# EAGLE design avr_saber_mini (EAGLE 6.5.0)
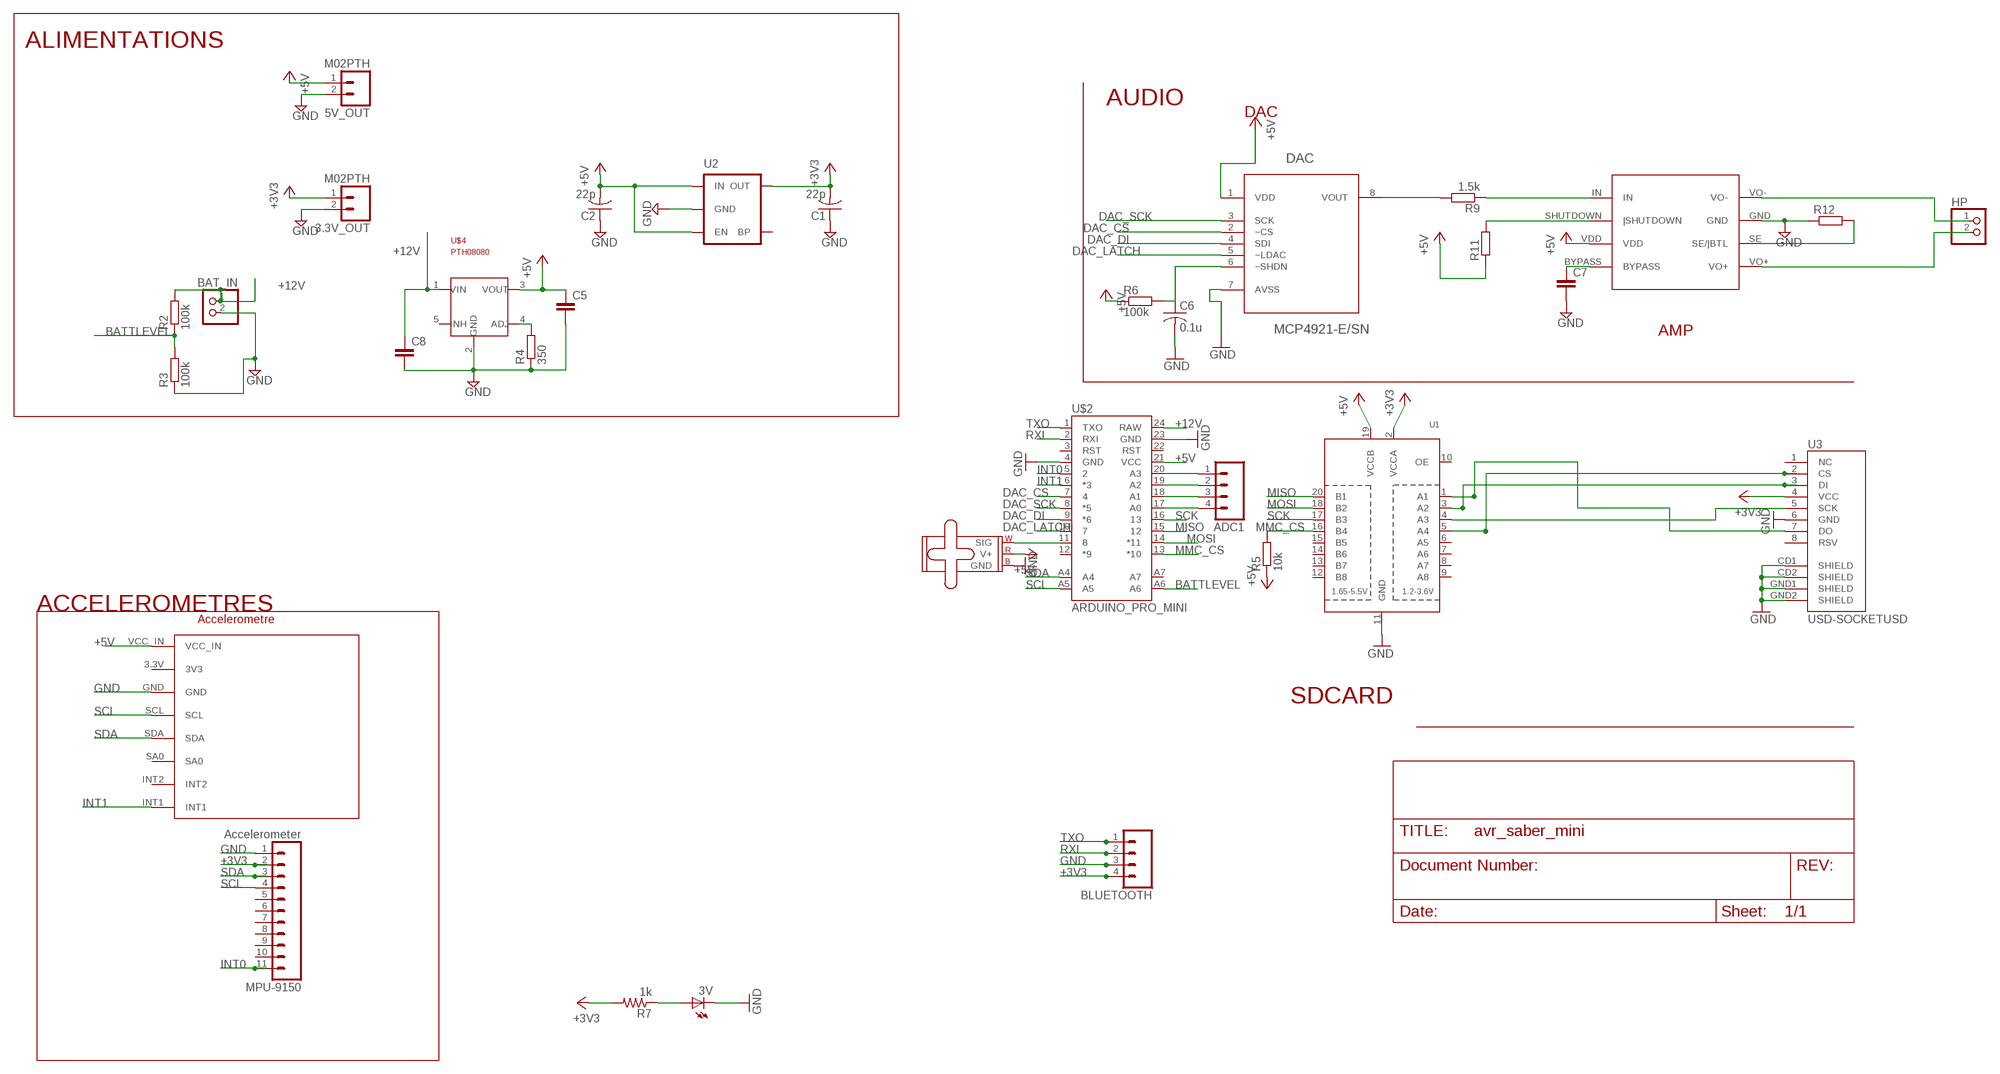
[diagram p0: schematic, sheet 1]

## Parts
3.3V_OUT  M02PTH  [1X02]
3V  LEDSML0805  [SML0805]
5V_OUT  M02PTH  [1X02]
ADC1  M04PTH  [1X04]
BAT_IN  PINHD-1X2  [1X02]
BLUETOOTH  M04PTH  [1X04]
C1  22p  C-USC0805  [C0805]
C2  22p  C-USC0805  [C0805]
C5  C-EUC1206K  [C1206K]
C6  0.1u  C-USC0805  [C0805]
C7  C-EU025-025X050  [C025-025X050]
C8  C-EUC1206K  [C1206K]
DAC  MCP4921-E/SN  [SOIC8-N_MC]
HP  PINHD-1X2  [1X02]
LED1  SMALL_SERVO  [1X03]
MMA8451  DEV  [MMA8451]
MPU-9150  Accelerometer  M11PTH  [1X11]
R2  100k  R-EU_R0805  [R0805]
R3  100k  R-EU_R0805  [R0805]
R4  350  R-EU_R0805  [R0805]
R5  10k  R-EU_R0805  [R0805]
R6  100k  R-EU_R0805  [R0805]
R7  1k  R-US_M0805  [M0805]
R9  1.5k  R-EU_R0805  [R0805]
R11  R-EU_R0805  [R0805]
R12  R-EU_R0805  [R0805]
U1  TXB0108PWR  [TSSOP20]
U2  MIC52053.3V  [SOT23-5]
U3  USD-SOCKETUSD  [USD-SOCKET-PP]
U$1  TPA0211  [TPA0211]
U$2  ARDUINO_PRO_MINI  [ARDUINO_PRO_MINI]
U$4  PTH08080  [PTH08080EUF]

## Nets
+3V3: 3.3V_OUT.1 BLUETOOTH.4 C1.2 MPU-9150.2 R7.2 U1.2(VCCA) U2.5(OUT) U3.4(VCC)
+5V: 5V_OUT.1 C2.2 C5.1 DAC.1(VDD) LED1.2(V+) MMA8451.VCC_IN R5.1 R6.1 R11.1 U1.19(VCCB) U2.1(IN) U2.3(EN) U$1.VDD U$2.21(VCC) U$4.3(VOUT)
+12V: BAT_IN.1 C8.1 R2.2 U$2.24(RAW) U$4.1(VIN)
BATTLEVEL: R2.1 R3.2 U$2.A6
DAC_CS: DAC.2(~CS) U$2.7
DAC_DI: DAC.4(SDI) U$2.9(*6)
DAC_LATCH: DAC.5(~LDAC) U$2.10
DAC_SCK: DAC.3(SCK) U$2.8(*5)
GND: 3.3V_OUT.2 3V.C 5V_OUT.2 BAT_IN.2 BLUETOOTH.3 C1.1 C2.1 C5.2 C6.2 C7.2 C8.2 DAC.7(AVSS) LED1.3(GND) MMA8451.GND MPU-9150.1 R3.1 R4.1 R12.1 U1.11(GND) U2.2(GND) U3.6(GND) U3.CD1(SHIELD) U3.CD2(SHIELD) U3.GND1(SHIELD) U3.GND2(SHIELD) U$1.GND U$2.4(GND) U$2.23(GND) U$4.2(GND)
INT0: MPU-9150.11 U$2.5
INT1: MMA8451.INT1 U$2.6(*3)
MISO: U1.20(B1) U$2.15
MMC_CS: R5.2 U1.16(B4) U$2.13(*10)
MOSI: U1.18(B2) U$2.14(*11)
N$3: R9.1 U$1.IN
N$4: ADC1.1 U$2.20(A3)
N$5: R4.2 U$4.4(ADJ)
N$6: U1.4(A3) U3.5(SCK)
N$7: U1.1(A1) U3.7(DO)
N$9: U1.5(A4) U3.2(CS)
N$10: 3V.A R7.1
N$11: U1.3(A2) U3.3(DI)
N$14: ADC1.2 U$2.19(A2)
N$15: DAC.8(VOUT) R9.2
N$16: ADC1.3 U$2.18(A1)
N$17: ADC1.4 U$2.17(A0)
N$18: LED1.1(SIG) U$2.11
N$19: C6.1 DAC.6(~SHDN) R6.2
N$22: HP.1 U$1.VO-
N$23: C7.1 U$1.BYPASS
N$32: R11.2 U$1.SHUTDOWN(|SHUTDOWN)
N$33: R12.2 U$1.SE(SE/|BTL)
RXI: BLUETOOTH.2 U$2.2(RXI)
SCK: U1.17(B3) U$2.16
SCL: MMA8451.SCL MPU-9150.4 U$2.A5
SDA: MMA8451.SDA MPU-9150.3 U$2.A4
TXO: BLUETOOTH.1 U$2.1(TXO)
VO+: HP.2 U$1.VO+
Unconnected: MMA8451.3.3V(3V3) MMA8451.INT2 MMA8451.SA0 MPU-9150.5 MPU-9150.6 MPU-9150.7 MPU-9150.8 MPU-9150.9 MPU-9150.10 U1.6(A5) U1.7(A6) U1.8(A7) U1.9(A8) U1.10(OE) U1.12(B8) U1.13(B7) U1.14(B6) U1.15(B5) U2.4(BP) U3.1(NC) U3.8(RSV) U$2.3(RST) U$2.12(*9) U$2.22(RST) U$2.A7 U$4.5(INH)

## Notes on the sheet
- ALIMENTATIONS
- AUDIO
- DAC
- AMP
- ACCELEROMETRES
- Accelerometre
- SDCARD

## Library data of the parts
3.3V_OUT 5V_OUT = SparkFun-Connectors:M02: Standard 2-pin 0.1" header. Use with - straight break away headers ( PRT-00116) - right angle break away headers (PRT-00553) - swiss pins (PRT-00743) - machine pins (PRT-00117) - female headers (PRT-00115) Molex polarized connector foot print use with: PRT-08233 with associated crimp pins and housings. 2.54_SCREWTERM for use with PRT-10571. 3.5mm Screw Terminal footprints for PRT-08084 5mm Screw Terminal footprints for use with PRT-08433
3V = led:LED: LED OSRAM: - CHIPLED LG R971, LG N971, LY N971, LG Q971, LY Q971, LO R971, LY R971 LH N974, LH R974 LS Q976, LO Q976, LY Q976 LO Q996 - Hyper CHIPLED LW Q18S LB Q993, LB Q99A, LB R99A - SideLED LS A670, LO A670, LY A670, LG A670, LP A670 LB A673, LV A673, LT A673, LW A673 LH A674 LY A675 LS A676, LA A676, LO A676, LY A676, LW A676 LS A679, LY A679, LG A679 - Hyper Micro SIDELED® LS Y876, LA Y876, LO Y876, LY Y876 LT Y87S - SmartLED LW L88C, LW L88S LB L89C, LB L89S, LG L890 LS L89K, LO L89K, LY L89K LS L896, LA L896, LO L896, LY L896 - TOPLED LS T670, LO T670, LY T670, LG T670, LP T670 LSG T670, LSP T670, LSY T670, LOP T670, LYG T670 LG T671, LOG T671, LSG T671 LB T673, LV T673, LT T673, LW T673 LH T674 LS T676, LA T676, LO T676, LY T676, LB T676, LH T676, LSB T676, LW T676 LB T67C, LV T67C, LT T67C, LS T67K, LO T67K, LY T67K, LW E67C LS E67B, LA E67B, LO E67B, LY E67B, LB E67C, LV E67C, LT E67C LW T67C LS T679, LY T679, LG T679 LS T770, LO T770, LY T770, LG T770, LP T770 LB T773, LV T773, LT T773, LW T773 LH T774 LS E675, LA E675, LY E675, LS T675 LS T776, LA T776, LO T776, LY T776, LB T776 LHGB T686 LT T68C, LB T68C - Hyper Mini TOPLED® LB M676 - Mini TOPLED Santana® LG M470 LS M47K, LO M47K, LY M47K Source: http://www.osram.convergy.de LUXEON: - LUMILED® LXK2-PW12-R00, LXK2-PW12-S00, LXK2-PW14-U00, LXK2-PW14-V00 LXK2-PM12-R00, LXK2-PM12-S00, LXK2-PM14-U00 LXK2-PE12-Q00, LXK2-PE12-R00, LXK2-PE12-S00, LXK2-PE14-T00, LXK2-PE14-U00 LXK2-PB12-K00, LXK2-PB12-L00, LXK2-PB12-M00, LXK2-PB14-N00, LXK2-PB14-P00, LXK2-PB14-Q00 LXK2-PR12-L00, LXK2-PR12-M00, LXK2-PR14-Q00, LXK2-PR14-R00 LXK2-PD12-Q00, LXK2-PD12-R00, LXK2-PD12-S00 LXK2-PH12-R00, LXK2-PH12-S00 LXK2-PL12-P00, LXK2-PL12-Q00, LXK2-PL12-R00 Source: www.luxeon.com KINGBRIGHT: KA-3528ASYC Source: www.kingbright.com
ADC1 BLUETOOTH = SparkFun-Connectors:M04: Header 4 Standard 4-pin 0.1" header. Use with straight break away headers (SKU : PRT-00116), right angle break away headers (PRT-00553), swiss pins (PRT-00743), machine pins (PRT-00117), and female headers (PRT-00115). Molex polarized connector foot print use with SKU : PRT-08231 with associated crimp pins and housings. 1MM SMD Version SKU: PRT-10208
BAT_IN HP = pinhead:PINHD-1X2: PIN HEADER
C1 C2 C6 = adafruit:C-US: CAPACITOR, American symbol
C5 C7 C8 = rcl:C-EU: CAPACITOR, European symbol
DAC = Microchip_By_element14_Batch_1:MCP4921-E/SN: 12 Bit DAC; DESCRIPTION: 12 Bit DAC; MPN: MCP4921-E/SN; OC_FARNELL: 1332113; OC_NEWARK: 08J8744; PACKAGE: SOIC-8; SUPPLIER: Microchip
LED1 = SparkFun-Electromechanical:SMALL_SERVO: Small servo motor This is the small servo used in the SIK. SKU: ROB-09065
MMA8451 = MMA8451_miniboard:DEV
MPU-9150 = SparkFun-Connectors:M11: Header 11 Standard 11-pin 0.1" header. Use with straight break away headers (SKU : PRT-00116), right angle break away headers (PRT-00553), swiss pins (PRT-00743), machine pins (PRT-00117), and female headers (PRT-00115).
R2-R6 R9 R11 R12 = rcl:R-EU_: RESISTOR, European symbol
R7 = rcl:R-US_: RESISTOR, American symbol
U1 = adafruit:TXB0108PWR: 8-Bit Bi-Directional Level Shifter 1.2V-3.6V (VCCA) to 1.65V-5.5V (VCCB) bi-directional level shifter with auto direction sensing. Max data rate - VCCA 1.8V: 20Mbps (50ns), VCCA 3.3V: 100Mbps (10ns) Digikey: 296-21527-1-ND
U2 = SparkFun-PowerIC:MIC5205: MIC5205 150mA vreg 3.3V - VREG-00822 5V - VREG-00823; PROD_ID: VREG-00822
U3 = SparkFun-Connectors:USD-SOCKET: microSD Socket Push-push type uSD socket. Schematic element and footprint production proven. Spark Fun Electronics SKU : PRT-00127. tDoc lines correctly indicate media card edge positions when inserting (unlocked, locked, depressed).
U$1 = TPA0211:TPA0211
U$2 = SparkFun-Boards:ARDUINO_PRO_MINI
U$4 = PTH08080:PTH08080: DC-DC, Vin 5..18V, Vout 2..6V, 2A www.ti.com

## Net classes
1 power: width 0.508 mm

## Board
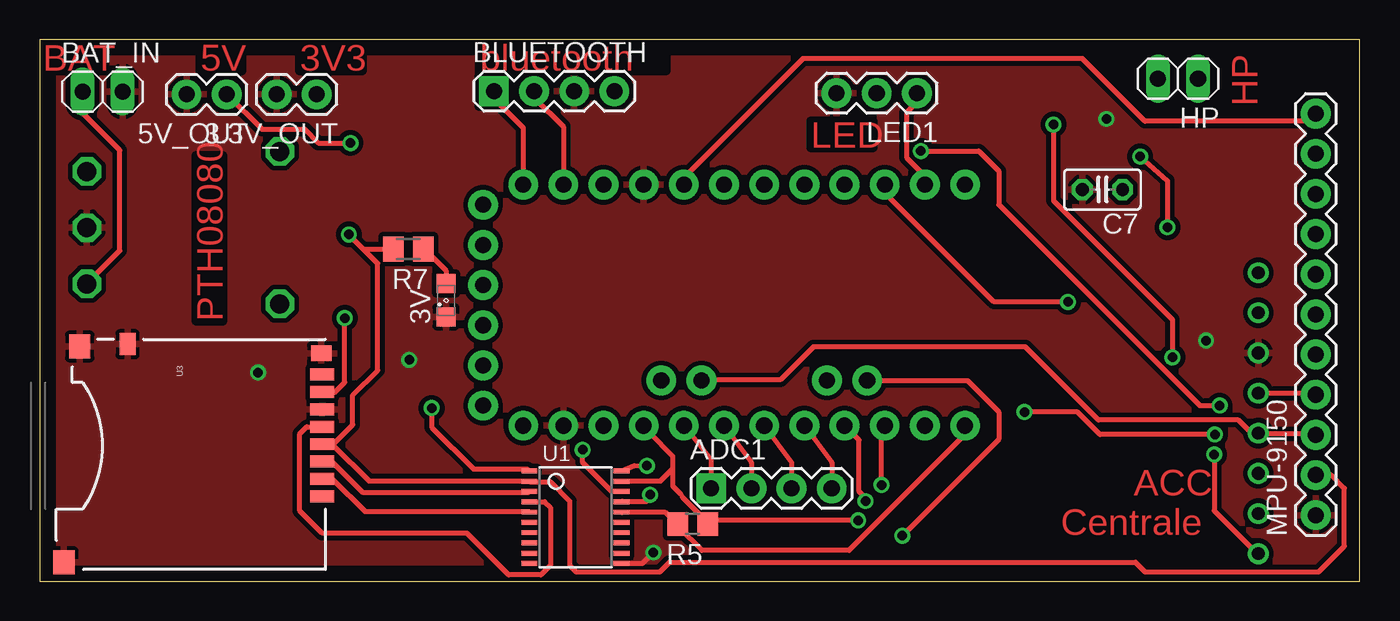
[diagram p1: board, top side]
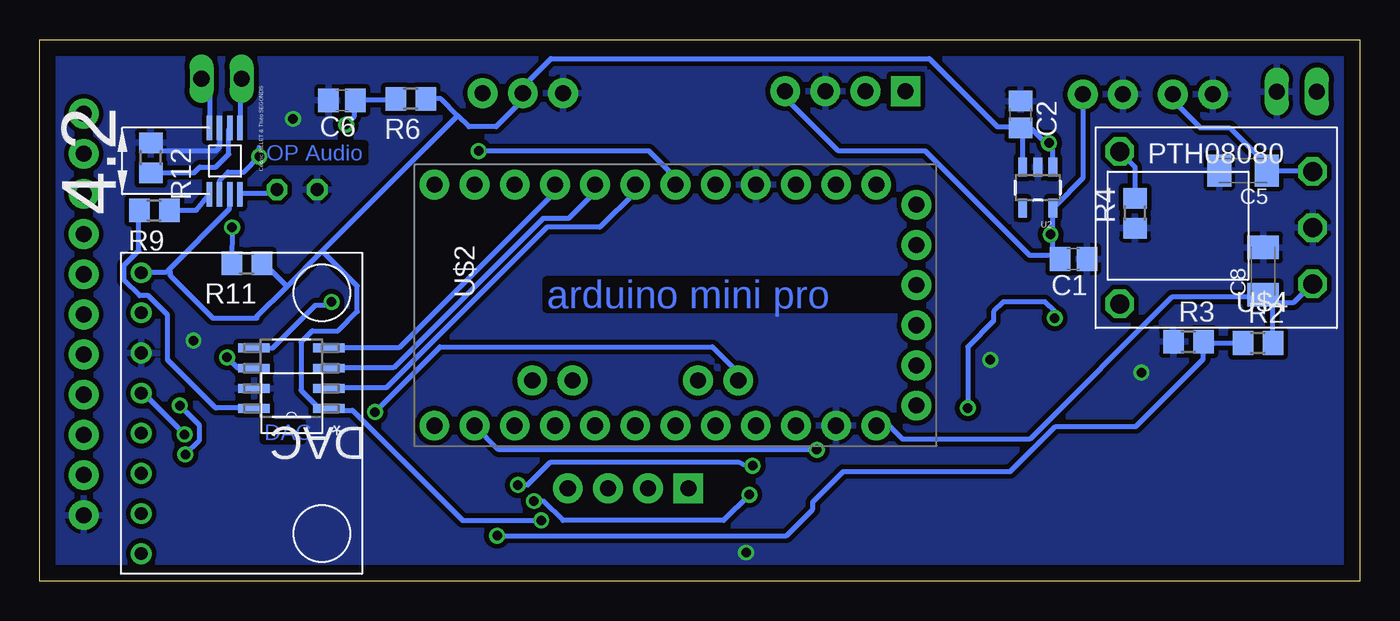
[diagram p2: board, bottom side, seen from below]

Size 83.49 x 34.28 mm. Coordinates in mm from the lower left corner, seen from the top.
Outline: 0,0 83.49,0 83.49,34.28 0,34.28 0,0
Copper layers (1*16): Top 0.035mm / dielectric 1.5mm / Bottom 0.035mm
Design rules "default *": minimum track width 12mil, minimum drill 0.6mm, track to track 10mil, track to pad 10mil, pad to pad 10mil, via to via 10mil, smd to smd 8mil, copper to edge 40mil, drill to drill 10mil, minimum pad ring 10mil, minimum via ring 8mil, stop-mask expansion 4mil, vias tented up to drill 0mil, thermal gap 10mil

### Footprints (pad centres in the part's own frame; a part is rotated, then mirrored left to right if it is on the bottom)
1X02 = drill 1.016 pad 1.88: 1 0,0; 2 2.54,0
SML0805 = smd 1.2 x 1.2: A 1.05,0; C -1.05,0
1X04 = drill 1.016 pad 1.88 square: 1 0,0 | drill 1.016 pad 1.88: 2 2.54,0; 3 5.08,0; 4 7.62,0
1X02' = drill 1.016 long: 1 -1.27,0; 2 1.27,0
C0805 = smd 1.3 x 1.5: 1 -0.85,0; 2 0.85,0
C1206K = smd 1.5 x 2: 1 -1.5,0; 2 1.5,0
C025-025X050 = drill 0.813 octagon: 1 -1.27,0; 2 1.27,0
SOIC8-N_MC = smd 1.981 x 0.559: 1 -2.362,1.905; 2 -2.362,0.635; 3 -2.362,-0.635; 4 -2.362,-1.905; 5 2.362,-1.905; 6 2.362,-0.635; 7 2.362,0.635; 8 2.362,1.905
1X03 = drill 1.016 pad 1.88: 1 0,0; 2 2.54,0; 3 5.08,0
MMA8451 = drill 0.8: 3.3V -7.62,6.35; GND -7.62,3.81; INT1 -7.62,-8.89; INT2 -7.62,-6.35; SA0 -7.62,-3.81; SCL -7.62,1.27; SDA -7.62,-1.27; VCC_IN -7.62,8.89
1X11 = drill 1.016 pad 1.88: 1 0,0; 2 2.54,0; 3 5.08,0; 4 7.62,0; 5 10.16,0; 6 12.7,0; 7 15.24,0; 8 17.78,0; 9 20.32,0; 10 22.86,0; 11 25.4,0
R0805 = smd 1.3 x 1.5: 1 -0.95,0; 2 0.95,0
M0805 = smd 1.3 x 1.6: 1 -0.95,0; 2 0.95,0
TSSOP20 = smd 0.305 x 0.991: 1 -2.925,-2.918; 2 -2.275,-2.918; 3 -1.625,-2.918; 4 -0.975,-2.918; 5 -0.325,-2.918; 6 0.325,-2.918; 7 0.975,-2.918; 8 1.625,-2.918; 9 2.275,-2.918; 10 2.925,-2.918; 11 2.925,2.918; 12 2.275,2.918; 13 1.625,2.918; 14 0.975,2.918; 15 0.325,2.918; 16 -0.325,2.918; 17 -0.975,2.918; 18 -1.625,2.918; 19 -2.275,2.918; 20 -2.925,2.918
SOT23-5 = smd 0.55 x 1.2: 1 -0.95,-1.3; 2 0,-1.3; 3 0.95,-1.3; 4 0.95,1.3; 5 -0.95,1.3
USD-SOCKET-PP = smd 0.75 x 1.5: 1 3.2,16.8; 2 2.1,16.8; 3 1,16.8; 4 -0.1,16.8; 5 -1.2,16.8; 6 -2.3,16.8; 7 -3.4,16.8; 8 -4.5,16.8 | smd 1 x 1.3: CD1 -5.85,16.75 | smd 1.4 x 1: CD2 -6.425,4.5 | smd 1.5 x 1.35: GND1 -6.275,1.475; GND2 7.375,0.475
TPA0211 = smd 1.55 x 0.35: BYPASS -2.1,-1.15; GND 2.1,0.15; IN -2.1,0.8; SE 2.1,-0.5; SHUTDOWN -2.1,0.15; VDD -2.1,-0.5; VO+ 2.1,-1.15; VO- 2.1,0.8
ARDUINO_PRO_MINI = drill 1.016 pad 1.88: 1 -7.62,12.7; 2 -7.62,10.16; 3 -7.62,7.62; 4 -7.62,5.08; 5 -7.62,2.54; 6 -7.62,0; 7 -7.62,-2.54; 8 -7.62,-5.08; 9 -7.62,-7.62; 10 -7.62,-10.16; 11 -7.62,-12.7; 12 -7.62,-15.24; 13 7.62,-15.24; 14 7.62,-12.7; 15 7.62,-10.16; 16 7.62,-7.62; 17 7.62,-5.08; 18 7.62,-2.54; 19 7.62,0; 20 7.62,2.54; 21 7.62,5.08; 22 7.62,7.62; 23 7.62,10.16; 24 7.62,12.7; A4 4.763,1.429; A5 4.763,3.969; A6 4.763,-9.049; A7 4.763,-6.509; BLK -6.35,15.24; GND -3.81,15.24; GRN 6.35,15.24; RXI 1.27,15.24; TXO 3.81,15.24; VCC -1.27,15.24
PTH08080EUF = drill 1.2 octagon: 1 0,0; 2 0,-3.556; 3 0,-7.112; 4 12.192,-8.382; 5 12.192,1.27

### Placement (x,y rotation side)
3.3V_OUT  17.53,30.81 180 top
3V  25.7,17.78 90 top
5V_OUT  11.84,30.81 180 top
ADC1  42.47,5.89 0 top
BAT_IN  [1X02']  3.99,30.99 0 top
BLUETOOTH  28.73,31.01 0 top
C1  18.11,20.4 180 bottom
C2  21.46,29.54 270 bottom
C5  7.39,25.98 180 bottom
C6  64.36,30.43 180 bottom
C7  67.21,24.79 180 top
C8  6.12,19.63 90 bottom
DAC  67.56,12.85 180 bottom
HP  [1X02']  71.98,31.8 180 top
LED1  55.47,30.89 180 top
MMA8451  69.44,10.64 0 bottom
MPU-9150  80.7,4.19 90 top
R2  6.45,15.09 0 bottom
R3  10.85,15.16 0 bottom
R4  14.22,23.29 90 bottom
R5  41.3,3.63 180 top
R6  60.02,30.53 180 bottom
R7  23.32,21.03 180 top
R9  76.23,23.47 180 bottom
R11  70.38,20.12 180 bottom
R12  76.45,26.8 270 bottom
U1  33.88,4.06 270 top
U2  20.37,24.92 180 bottom
U3  1.07,8.59 270 top
U$1  71.96,26.59 90 bottom
U$2  43.28,17.48 270 bottom
U$4  3,18.82 180 bottom

### Tracks (layer width: path | path; a pad name or v marks a point on that pad's centre or on a via)
+3V3  (via drill 0.6)
  Top 0.305: 20.47,21.03 R7.2 | v19.56,21.95 20.47,21.03 | 18.54,8.64 20.83,6.35 30.94,6.35 U1.2 31.01,6.3 32.31,6.3 33.53,5.08 33.53,1.02 33.93,0.61 39.22,0.61 39.83,1.22 69.29,1.22 69.9,0.61 80.87,0.61 82.5,2.23 82.5,5.89 81.66,6.73 MPU-9150.2 | 18.54,8.64 17.88,8.64 U3.4 | 18.54,8.64 19.81,9.91 19.81,11.79 21.39,13.36 21.39,20.12 20.47,21.03
  Bottom 0.305: 19.41,21.95 19.41,20.83 19,20.42 C1.2 19.41,20.62 20.88,20.62 27.48,27.23 32.97,27.23 36.32,30.58 36.32,30.99 BLUETOOTH.4 | 19.41,21.95 19.41,23.57 U2.5 19.3,23.72 17.53,25.5 3.3V_OUT.1 | v19.56,21.95 19.41,21.95
+5V  (via drill 0.6)
  Top 0.305: v19.66,27.74 17.63,27.74 16.76,28.6 14.07,28.6 11.84,30.84 5V_OUT.1 | U$2.21 38.56,9.5 38.56,9.4 40.03,7.92 40.03,7.11 | U1.19 36.83,6.35 39.27,6.35 40.03,7.11 | v51.77,3.86 42.32,3.86 R5.1 42.22,3.66 42.22,3.76 40.64,5.33 40.54,5.54 40.03,6.04 40.03,7.11
  Bottom 0.305: U$4.3 3,25.96 5.84,25.96 C5.1 5.99,26.11 5.99,26.47 8.23,28.7 10.11,28.7 11.84,30.43 5V_OUT.1 | 19.76,27.64 20.78,28.65 21.44,28.65 C2.2 | 19.76,27.64 19.46,27.33 19.46,26.26 U2.1 | U2.3 21.34,26.26 21.34,28.55 C2.2 | v19.66,27.74 19.76,27.64 | R6.1 58.12,30.53 57.05,29.46 | 57.05,29.46 56.34,28.75 54.61,28.75 52.93,30.43 LED1.2 52.83,30.99 52.83,31.39 51.16,33.07 27.23,33.07 22.91,28.75 21.59,28.75 C2.2 | 75.34,19.71 75.49,19.56 77.06,19.56 MMA8451.VCC_IN | 75.34,19.71 71.48,23.57 71.48,24.49 U$1.VDD | 75.34,19.71 75.23,19.61 75.23,19.36 72.54,16.66 69.75,16.66 69.75,16.76 67.84,18.67 | 67.84,18.67 65.61,20.9 | 65.61,20.9 57.05,29.46 | v51.77,3.86 56.74,3.86 63.7,10.82 65.13,10.82 DAC.1 65.23,10.97 65.84,10.97 66.95,12.09 66.95,15.14 66.24,15.85 64.62,15.85 63.4,17.07 63.4,18.69 65.61,20.9 | R11.1 69.29,20.12 67.84,18.67
+12V
  Top 0.305: BAT_IN.1 2.74,30.99 2.74,29.62 5.08,27.28 5.08,20.93 3,18.85 U$4.1
  Bottom 0.305: R2.2 5.54,15.09 5.54,17.53 6.1,18.09 C8.1 | C8.1 5.44,17.63 4.22,17.63 3,18.85 U$4.1 | U$2.24 29.77,9.86 28.91,8.99 20.88,8.99 11.89,17.98 6.2,17.98 C8.1
BATTLEVEL  (via drill 0.6)
  Top 0.305: v54.56,2.9 60.66,8.99 60.66,10.72 58.67,12.7 52.38,12.7 U$2.A6
  Bottom 0.305: R2.1 9.8,15.09 9.86,15.14 R3.2 9.91,14.99 9.91,14.07 14.17,9.8 19.25,9.8 22.1,6.96 32.66,6.96 34.59,5.03 34.59,4.57 36.27,2.9 v54.56,2.9
DAC_CS
  Bottom 0.305: U$2.7 45.82,24.64 48.06,22.4 51.41,22.4 61.57,12.24 65.18,12.24 DAC.2
DAC_DI
  Bottom 0.305: U$2.9 50.9,24.64 60.76,14.78 65.18,14.78 DAC.4
DAC_LATCH  (via drill 0.6)
  Top 0.305: v65.02,17.68 60.35,17.68 53.65,24.38 53.65,24.89 U$2.10
  Bottom 0.305: DAC.5 68.76,14.76 66.04,17.48 65.23,17.48 v65.02,17.68
DAC_SCK
  Bottom 0.305: U$2.8 48.36,24.64 50.04,22.96 51.66,22.96 61.11,13.51 65.18,13.51 DAC.3
GND  (via drill 0.6)
  Top 0.305: U1.11 38.12,1.14 v38.81,1.83
  Bottom 0.305: U$1.GND 72.11,27.46 72.34,27.23 75.94,27.23 R12.1 | v38.81,1.83 38.61,1.83
  other vias: 13.82,13.21 73.76,15.24 23.37,14.02 67.46,29.26
  pour Top (isolate 0.305): 0.2,34.34 83.31,34.34 83.31,-0.2 0.2,-0.2
  pour Bottom (isolate 0.305): 0.2,34.34 83.31,34.34 83.31,-0.2 0.2,-0.2
INT0
  Top 0.305: U$2.5 40.74,25.55 48.26,33.07 65.94,33.07 69.9,29.11 80.21,29.11 MPU-9150.11
INT1  (via drill 0.6)
  Top 0.305: v74.27,8.03 74.27,4.47 76.96,1.78 77.06,1.78 MMA8451.INT1 | v74.62,11.12 73.36,11.12 60.66,23.82 60.66,25.96 59.38,27.23 v55.73,27.23
  Bottom 0.305: v74.27,8.03 73.41,8.89 73.41,9.91 v74.62,11.12 | v55.73,27.23 44.96,27.23 43.28,25.55 U$2.6
MISO  (via drill 0.6)
  Top 0.305: U1.20 37.61,7.34 v38.41,7.32 | v53.24,6.1 53.24,9.65 U$2.15
  Bottom 0.305: v38.41,7.32 38.81,7.32 39.22,7.52 51.21,7.52 52.63,6.1 v53.24,6.1
MMC_CS
  Top 0.305: U1.16 36.83,4.37 39.57,4.37 40.34,3.61 R5.2 40.44,3.5 40.44,3.4 41.88,1.96 51.19,1.96 58.52,9.3 U$2.13
MOSI  (via drill 0.6)
  Top 0.305: U1.18 36.17,5.69 34.34,7.52 v34.34,8.33
  Bottom 0.305: v34.34,8.33 54.46,8.33 U$2.14
N$3
  Bottom 0.305: R9.1 73.61,23.47 72.8,24.49 U$1.IN
N$4
  Top 0.305: ADC1.1 42.47,7.72 U$2.20
N$5
  Bottom 0.305: R4.2 14.22,26.21 15.19,27.18 U$4.4
N$6
  Top 0.305: U1.4 31.94,5.04 32.31,4.67 32.31,1.02 31.7,0.41 29.67,0.41 27.03,3.05 17.88,3.05 16.46,4.47 16.46,9.35 16.9,9.79 U3.5
N$7  (via drill 0.6)
  Top 0.305: U3.7 18.69,11.98 19.3,12.6 v19.3,16.66 | v24.79,10.97 24.79,9.75 27.43,7.11 30.84,7.11 U1.1
  Bottom 0.305: v19.3,16.66 19.3,17.07 19.91,17.68 22.55,17.68 23.16,17.07 23.16,16.46 24.79,14.83 v24.79,10.97
N$9
  Top 0.305: U1.5 30.94,4.42 20.57,4.42 18.54,6.45 17.88,6.45 U3.2
N$10
  Top 0.305: 3V.A 25.7,19.66 24.33,21.03 R7.1
N$11
  Top 0.305: U1.3 30.94,5.64 20.42,5.64 18.49,7.57 17.88,7.57 U3.3
N$14
  Top 0.305: ADC1.2 45.01,7.52 U$2.19
N$15
  Bottom 0.305: R9.2 77.22,23.88 77.22,20.93 78.13,20.02 78.13,19.05 77.17,18.09 76.61,18.09 75.39,16.87 75.39,14.02 72.34,10.97 69.95,10.97 DAC.8
N$16
  Top 0.305: ADC1.3 47.55,7.52 U$2.18
N$17
  Top 0.305: ADC1.4 50.09,7.52 U$2.17
N$18
  Top 0.305: U$2.11 55.98,25.65 54.81,26.82 54.81,29.67 55.47,30.33 LED1.1
N$19  (via drill 0.6)
  Top 0.305: v71.63,14.17 71.63,16.56 64.11,24.08 v64.11,28.91
  Bottom 0.305: R6.2 61.01,30.53 61.11,30.43 C6.1 63.6,30.33 63.6,29.41 v64.11,28.91 | v71.63,14.17 70.97,13.51 69.95,13.51 DAC.6
N$22
  Bottom 0.305: HP.1 72.75,31.29 72.75,28.7 U$1.VO-
N$23
  Bottom 0.305: C7.1 68.73,24.54 70.76,24.54 U$1.BYPASS
N$32  (via drill 0.6)
  Top 0.305: v71.32,22.4 71.32,25.35 v69.6,26.87
  Bottom 0.305: v71.32,22.4 R11.2 | v69.6,26.87 70.56,25.91 71.58,25.91 72.08,25.4 72.08,24.54 U$1.SHUTDOWN
N$33
  Bottom 0.305: R12.2 73.72,25.85 73.36,26.21 72.34,26.21 71.53,27.03 71.53,28.63 U$1.SE
RXI
  Top 0.305: U$2.2 33.12,28.75 31.29,30.58 31.29,30.99 BLUETOOTH.2
SCK  (via drill 0.6)
  Top 0.305: U1.17 36.84,5.08 38.41,5.08 38.61,5.28 v38.61,5.49 | v52.22,5.08 52.22,5.28 51.82,5.69 51.82,8.94 U$2.16
  Bottom 0.305: v38.61,5.49 40.23,3.86 50.39,3.86 51.61,5.08 v52.22,5.08
SCL  (via drill 0.6)
  Top 0.305: MPU-9150.4 80.62,11.89 77.06,11.89 MMA8451.SCL | v62.28,10.72 65.63,10.72 67.06,9.3 v74.32,9.3
  Bottom 0.305: v62.28,10.72 58.17,14.83 40.95,14.83 39.32,13.21 39.32,12.75 U$2.A5 | v74.32,9.3 76.91,11.89 77.06,11.89 MMA8451.SCL
SDA
  Top 0.305: MPU-9150.3 80.62,9.35 77.06,9.35 MMA8451.SDA 76.96,9.45 76.56,9.45 75.79,10.21 66.95,10.21 62.33,14.83 48.92,14.83 46.84,12.75 41.86,12.75 U$2.A4
TXO
  Top 0.305: U$2.1 30.58,28.7 28.75,30.53 28.75,30.99 BLUETOOTH.1
VO+
  Bottom 0.305: HP.2 70.81,31.7 70.81,28.7 U$1.VO+

### Text on the board
Top: BAT | 5V | 3V3 | bluetooth | HP | LED | PTH08080 | ACC / Centrale
Bottom: AOP Audio | arduino mini pro | DAC